# Altium schematic sheet Main.SchDoc
size A4
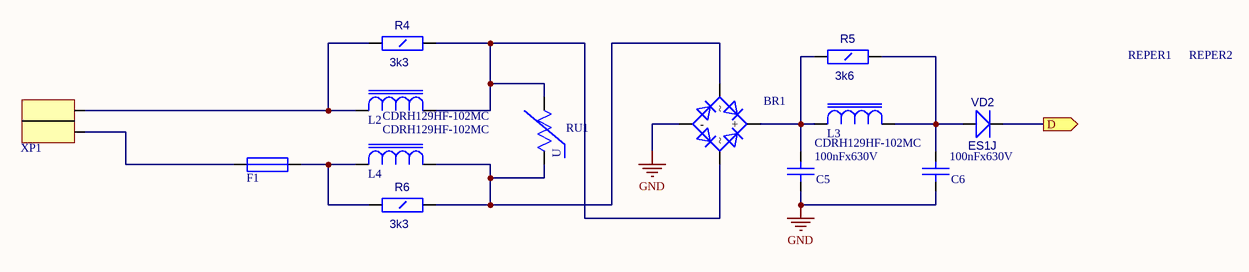
[diagram p0: Main.SchDoc]

## Parts
BR1  DF10S  [SDIP]  (value not drawn)
C5  100nFx630V  [CAP_630V_SMD]
C6  100nFx630V  [CAP_630V_SMD]
F1  *  [Fuse Belfuse]  (value not drawn)
L2  CDRH129HF-102MC  [IND_CDRH129]
L3  CDRH129HF-102MC  [IND_CDRH129]
L4  CDRH129HF-102MC  [IND_CDRH129]
R4  3k3  [RC1206]
R5  3k6  [RC1206]
R6  3k3  [RC1206]
REPER1  REPER1.2  [REPER1.2]  (value not drawn)
REPER2  REPER1.2  [REPER1.2]  (value not drawn)
RU1  KLS6-07D  [Varistor_7mm_SMD]  (value not drawn)
VD2  ES1J  [SMA]
XP1  *  [Poke-In 2pin]  (value not drawn)

## Ports
D (out)

## Nets
GND: BR1.2(-) C5.1(A) C6.1(A)
D: VD2.2(K) ; port D
NetBR1_1: BR1.1(+) C5.2(B) L3.1(A) R5.1(A)
NetBR1_3: BR1.3 L4.2(B) R6.2(B) RU1.1(A)
NetBR1_4: BR1.4 L2.2(B) R4.2(B) RU1.2(B)
NetC6_2: C6.2(B) L3.2(B) R5.2(B) VD2.1(A)
NetF1_1: F1.1 XP1.4
NetF1_2: F1.2 L4.1(A) R6.1(A)
NetL2_1: L2.1(A) R4.1(A) XP1.3

Not connected (* = marked no-connect by the designer): REPER1 1; REPER2 1

## Notes on the sheet
- (in symbol KLS6-07D) U

## Library data of the parts
C5 C6 = Cap_HV: Value: 100nFx630V
F1 = Fuse Belufse: Value: *
L2-L4 = CDRH129: Value: CDRH129HF-102MC
R4-R6 = RC1206
  R4 R6: Value: 3k3
  R5: Value: 3k6
VD2 = SS14: Schottky Rectifier; OriginalName: 10BQ100; ComponentField6: Published 8-Jun-2000, Modified 10-July-2000: SIM Model Added.; Value: ES1J
XP1 = Poke-IN 2Pin: Value: *
BR1 = DF10S: Value: DF10S
REPER1 REPER2 = REPER1.2: Value: *
RU1 = KLS6-07D: Value: KLS6-07D